# EAGLE schematic Pololu Magnetic Encoder (Floating) Motor Mount (EAGLE 6.4)
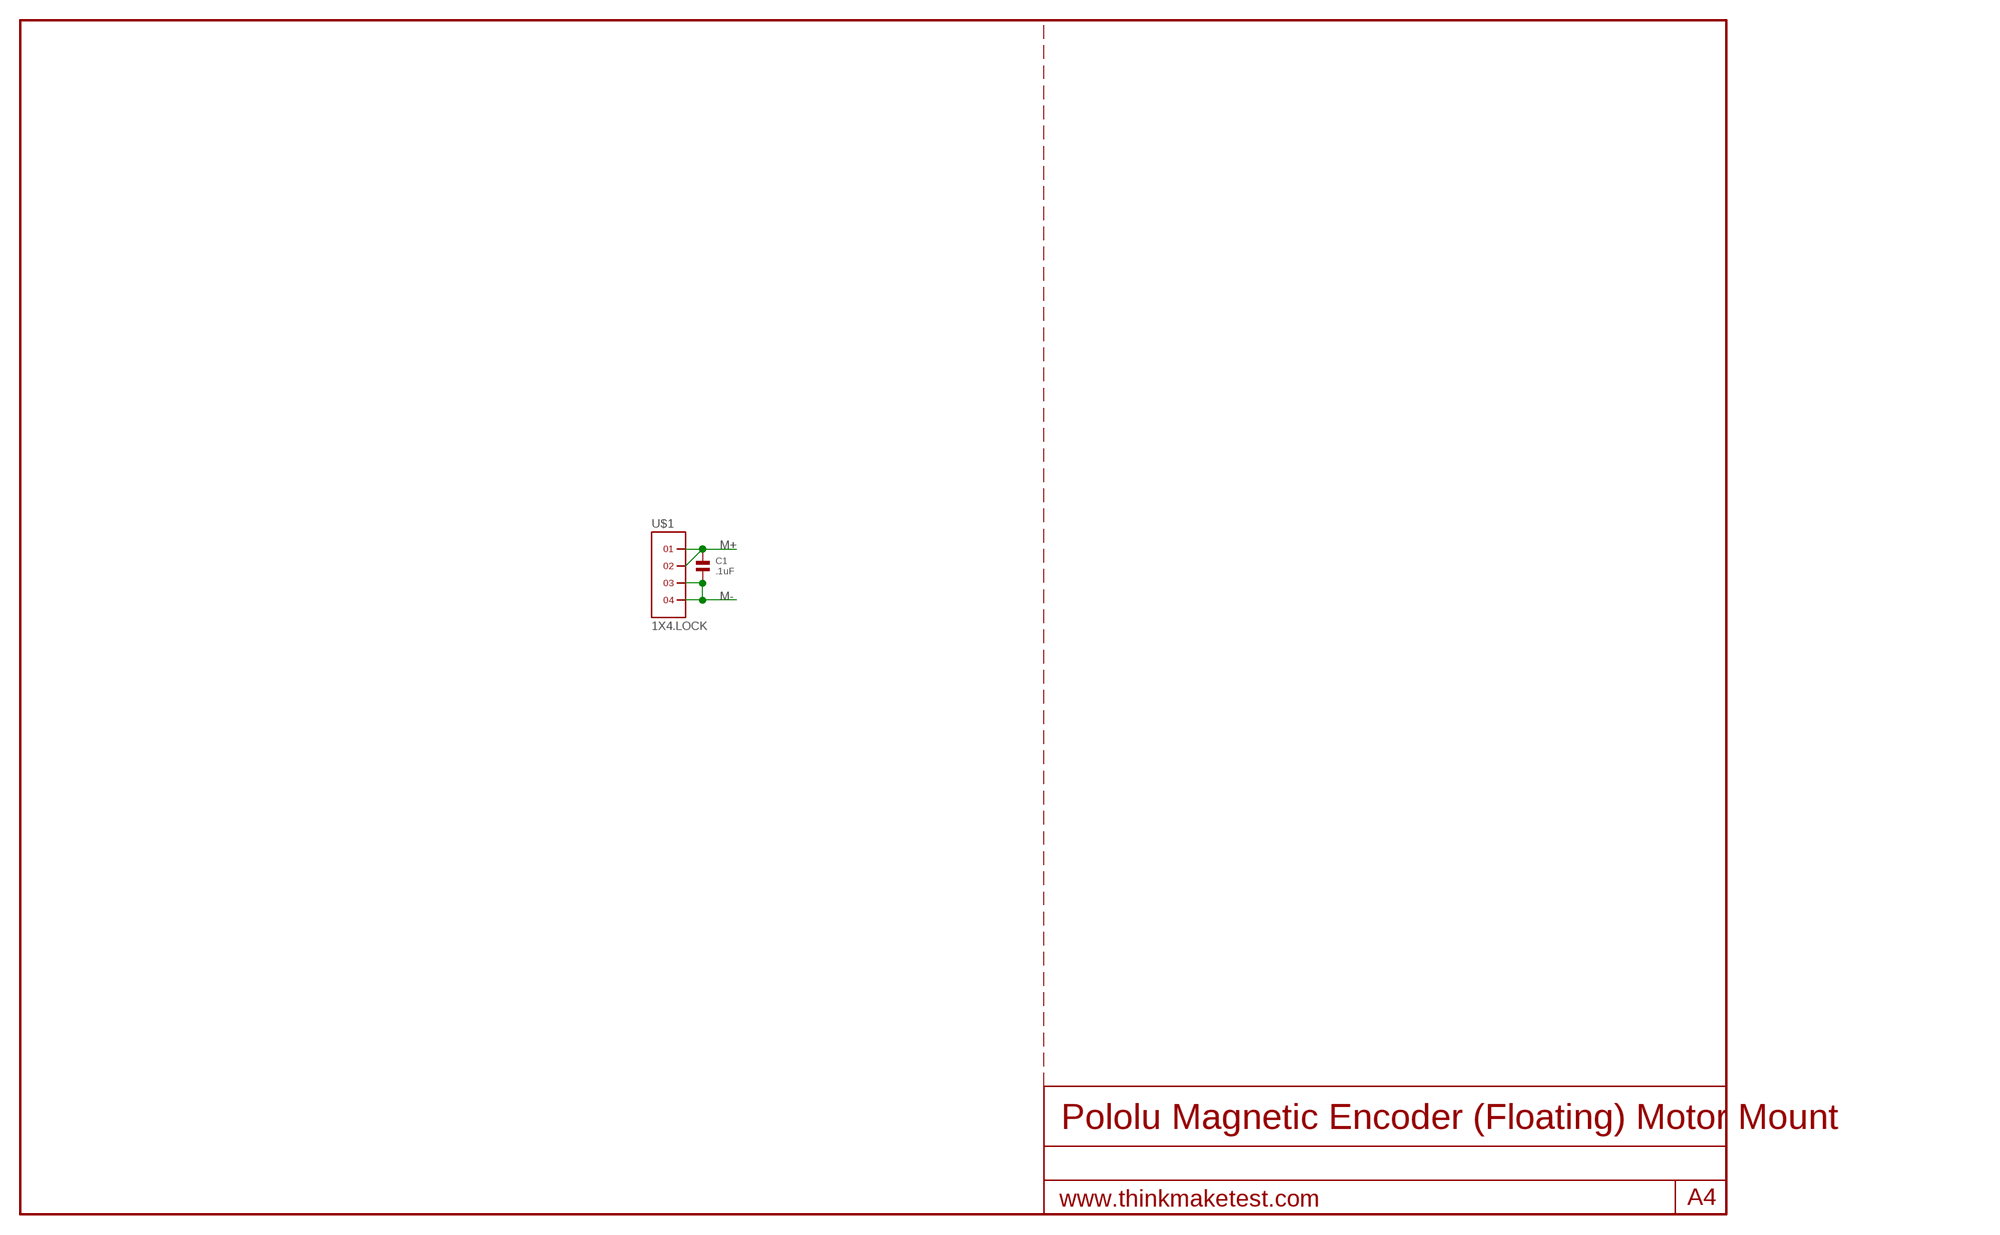
[diagram p0: schematic, sheet 1]

## Parts
C1  .1uF  CAPACITOR.0603  [0603]
U$1  1X4.LOCK  [1X4.LOCK]

## Nets
M+: C1.1 U$1.1 U$1.2
M-: C1.2 U$1.3 U$1.4

## Library data of the parts
C1 = standardparts:CAPACITOR
U$1 = headers(.05in):1X4